# EAGLE schematic LEDMatrix (EAGLE 9.6.2)
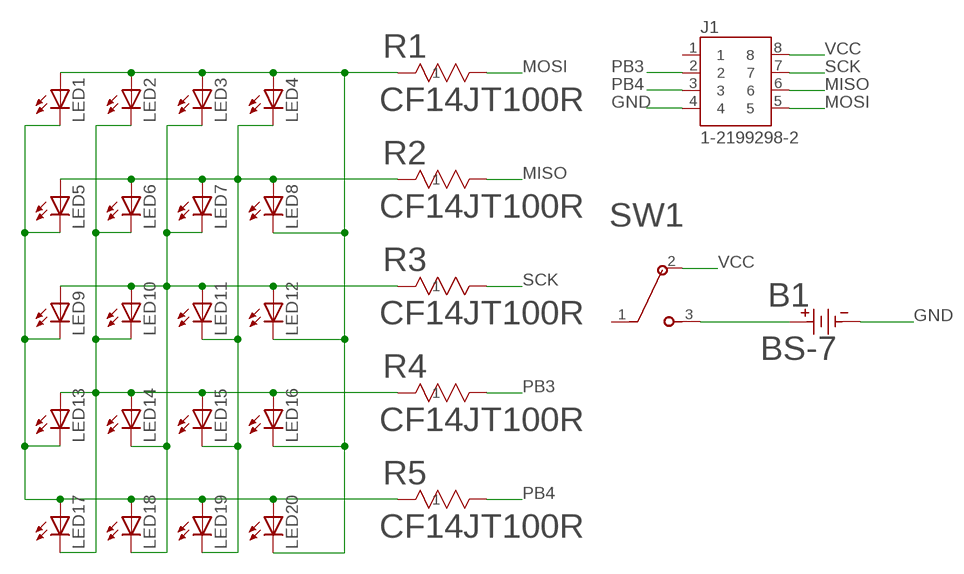
[diagram p0: schematic, sheet 1]

## Parts
B1  BS-7  [BS-7_MPD]
J1  1-2199298-2  [TE_1-2199298-2]
LED1  LED3MM  [LED3MM]
LED2  LED3MM  [LED3MM]
LED3  LED3MM  [LED3MM]
LED4  LED3MM  [LED3MM]
LED5  LED3MM  [LED3MM]
LED6  LED3MM  [LED3MM]
LED7  LED3MM  [LED3MM]
LED8  LED3MM  [LED3MM]
LED9  LED3MM  [LED3MM]
LED10  LED3MM  [LED3MM]
LED11  LED3MM  [LED3MM]
LED12  LED3MM  [LED3MM]
LED13  LED3MM  [LED3MM]
LED14  LED3MM  [LED3MM]
LED15  LED3MM  [LED3MM]
LED16  LED3MM  [LED3MM]
LED17  LED3MM  [LED3MM]
LED18  LED3MM  [LED3MM]
LED19  LED3MM  [LED3MM]
LED20  LED3MM  [LED3MM]
R1  CF14JT100R  [STA_CF14_STP]
R2  CF14JT100R  [STA_CF14_STP]
R3  CF14JT100R  [STA_CF14_STP]
R4  CF14JT100R  [STA_CF14_STP]
R5  CF14JT100R  [STA_CF14_STP]
SW1  EG1218  [SW_1218_EWI]

## Nets
GND: B1.1 J1.4
MISO: J1.6 R2.2
MOSI: J1.5 R1.2
N$1: LED1.A LED2.A LED3.A LED4.A LED8.K(C) LED12.K(C) LED16.K(C) LED20.K(C) R1.1
N$2: LED4.K(C) LED5.A LED6.A LED7.A LED8.A LED11.K(C) LED15.K(C) LED19.K(C) R2.1
N$3: LED3.K(C) LED7.K(C) LED9.A LED10.A LED11.A LED12.A LED14.K(C) LED18.K(C) R3.1
N$4: LED2.K(C) LED6.K(C) LED10.K(C) LED13.A LED14.A LED15.A LED16.A LED17.K(C) R4.1
N$5: LED1.K(C) LED5.K(C) LED9.K(C) LED13.K(C) LED17.A LED18.A LED19.A LED20.A R5.1
N$7: B1.2 SW1.3
PB3: J1.2 R4.2
PB4: J1.3 R5.2
SCK: J1.7 R3.2
VCC: J1.8 SW1.2
Unconnected: J1.1 SW1.1

## Library data of the parts
B1 = BS-7:BS-7; BUILT_BY: EMA_Cory; COPYRIGHT: Copyright (C) 2018 Accelerated Designs. All rights reserved; DATASHEET: http://www.memoryprotectiondevices.com/datasheets/BS-7-datasheet.pdf; MANUFACTURER_PART_NUMBER: BS-7; SOURCELIBRARY: Memory_Protection_Devices_2020-03-04; VENDOR: Memory Protection Devices, Inc
J1 = 8pinsocket:1-2199298-2: CONN IC DIP SOCKET 8POS TIN; COMMENT: 1-2199298-2; DESCRIPTION: 8 (2 x 4) Pos DIP, 0.3 (7.62mm) Row Spacing Socket Tin Through Hole; DIGI-KEY_PART_NUMBER: A120347-ND; MF: TE Connectivity; MP: 1-2199298-2; PACKAGE: None; PURCHASE-URL: https://pricing.snapeda.com/search/part/1-2199298-2/?ref=eda
LED1-LED20 = adafruit:LED: LED OSRAM: - CHIPLED LG R971, LG N971, LY N971, LG Q971, LY Q971, LO R971, LY R971 LH N974, LH R974 LS Q976, LO Q976, LY Q976 LO Q996 - Hyper CHIPLED LW Q18S LB Q993, LB Q99A, LB R99A - SideLED LS A670, LO A670, LY A670, LG A670, LP A670 LB A673, LV A673, LT A673, LW A673 LH A674 LY A675 LS A676, LA A676, LO A676, LY A676, LW A676 LS A679, LY A679, LG A679 - Hyper Micro SIDELED® LS Y876, LA Y876, LO Y876, LY Y876 LT Y87S - SmartLED LW L88C, LW L88S LB L89C, LB L89S, LG L890 LS L89K, LO L89K, LY L89K LS L896, LA L896, LO L896, LY L896 - TOPLED LS T670, LO T670, LY T670, LG T670, LP T670 LSG T670, LSP T670, LSY T670, LOP T670, LYG T670 LG T671, LOG T671, LSG T671 LB T673, LV T673, LT T673, LW T673 LH T674 LS T676, LA T676, LO T676, LY T676, LB T676, LH T676, LSB T676, LW T676 LB T67C, LV T67C, LT T67C, LS T67K, LO T67K, LY T67K, LW E67C LS E67B, LA E67B, LO E67B, LY E67B, LB E67C, LV E67C, LT E67C LW T67C LS T679, LY T679, LG T679 LS T770, LO T770, LY T770, LG T770, LP T770 LB T773, LV T773, LT T773, LW T773 LH T774 LS E675, LA E675, LY E675, LS T675 LS T776, LA T776, LO T776, LY T776, LB T776 LHGB T686 LT T68C, LB T68C - Hyper Mini TOPLED® LB M676 - Mini TOPLED Santana® LG M470 LS M47K, LO M47K, LY M47K Source: http://www.osram.convergy.de/
R1-R5 = 100Resistor:CF14JT100R; BUILT_BY: EMA_UL_Team; MANUFACTURER_PART_NUMBER: CF14JT100R; SOURCELIBRARY: Stackpole_2014-12-31; VENDOR: Stackpole International
SW1 = EG1218:EG1218; BUILT_BY: EMA_Matt; COPYRIGHT: Copyright (C) 2018 Accelerated Designs. All rights reserved; DATASHEET: https://datasheet.octopart.com/EG1218-E-Switch-datasheet-13225248.pdf; MANUFACTURER_PART_NUMBER: EG1218; SOURCELIBRARY: E-Switch_2020-04-02; VENDOR: E-Switch